# Altium schematic sheet Sheet1.SchDoc
size A4; SheetNumber: 1; SheetTotal: 1
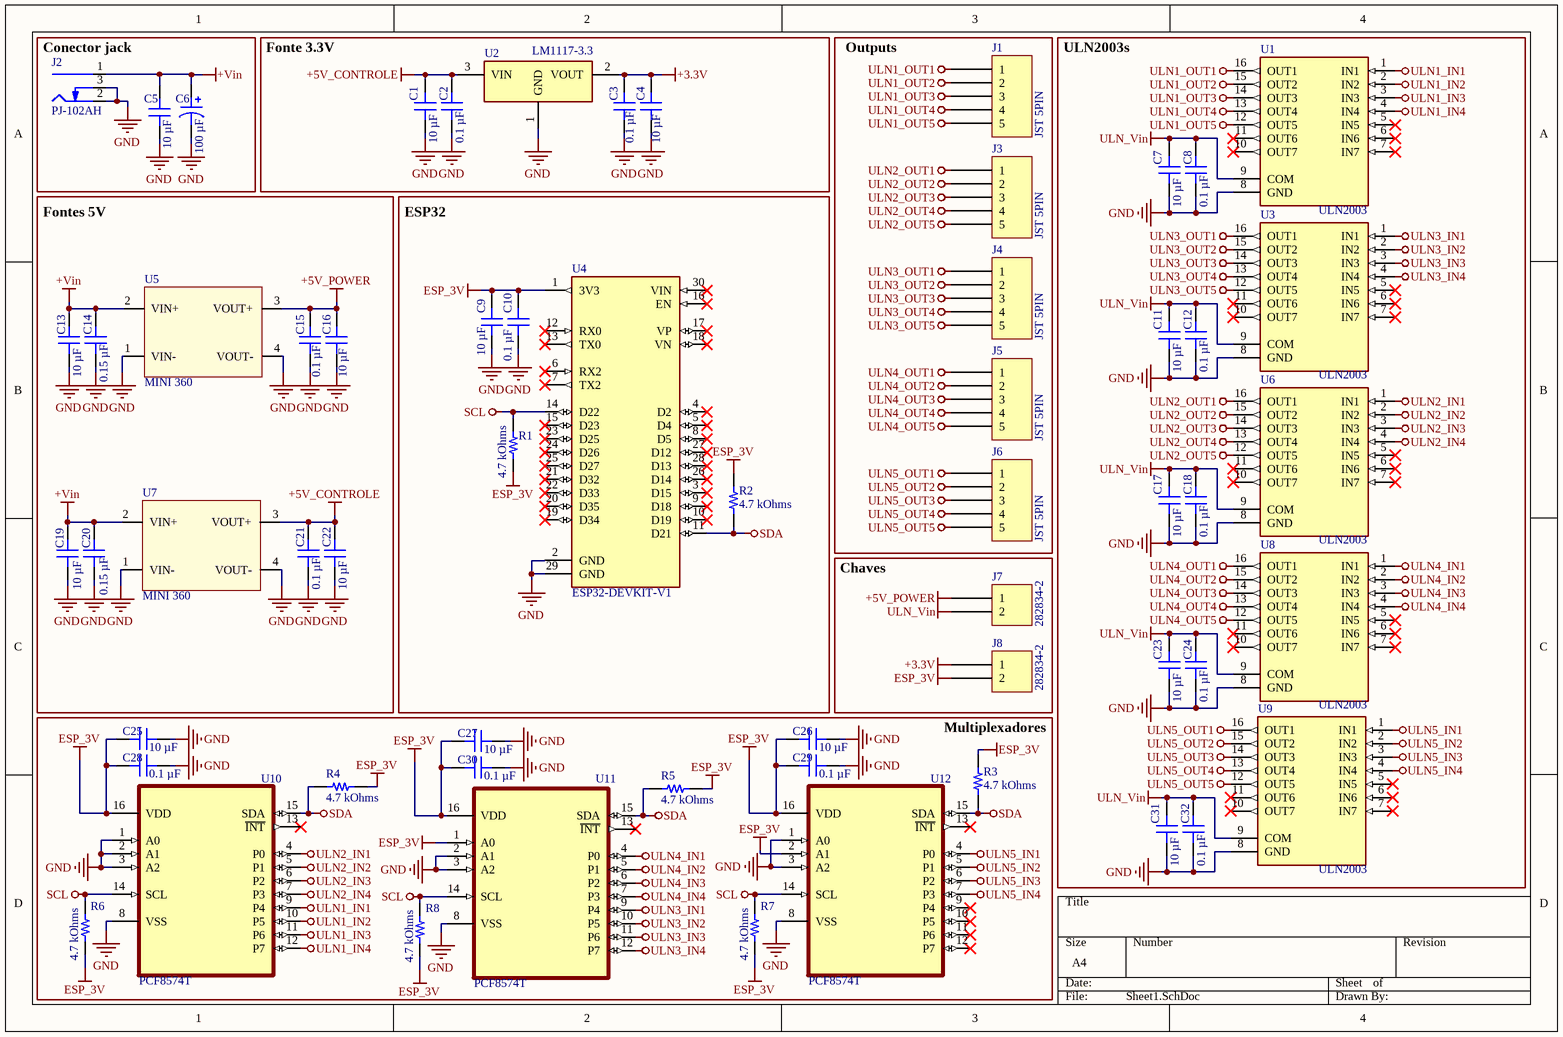
[diagram p0: Sheet1.SchDoc]

## Parts
C1  10 µF  [CAP 0603_1608]
C2  0.1 µF  [CAP 0603_1608]
C3  0.1 µF  [CAP 0603_1608]
C4  10 µF  [CAP 0603_1608]
C5  10 µF  [CAP 1206_3216 - 0.8MM]
C6  100 µF  [CAP AL TH D8 L3.5 H12.5]
C7  10 µF  [CAP 0603_1608]
C8  0.1 µF  [CAP 0603_1608]
C9  10 µF  [CAP 0603_1608]
C10  0.1 µF  [CAP 0603_1608]
C11  10 µF  [CAP 0603_1608]
C12  0.1 µF  [CAP 0603_1608]
C13  10 µF  [CAP 1206_3216 - 0.8MM]
C14  0.15 µF  [CAP 0805_2012]
C15  0.1 µF  [CAP 0603_1608]
C16  10 µF  [CAP 0603_1608]
C17  10 µF  [CAP 0603_1608]
C18  0.1 µF  [CAP 0603_1608]
C19  10 µF  [CAP 1206_3216 - 0.8MM]
C20  0.15 µF  [CAP 0805_2012]
C21  0.1 µF  [CAP 0603_1608]
C22  10 µF  [CAP 0603_1608]
C23  10 µF  [CAP 0603_1608]
C24  0.1 µF  [CAP 0603_1608]
C25  10 µF  [CAP 0603_1608]
C26  10 µF  [CAP 0603_1608]
C27  10 µF  [CAP 0603_1608]
C28  0.1 µF  [CAP 0603_1608]
C29  0.1 µF  [CAP 0603_1608]
C30  0.1 µF  [CAP 0603_1608]
C31  10 µF  [CAP 0603_1608]
C32  0.1 µF  [CAP 0603_1608]
J1  JST 5PIN  [JST XH B5B-XH-A]
J2  PJ-102AH  [CUI PJ-102AH]
J3  JST 5PIN  [JST XH B5B-XH-A]
J4  JST 5PIN  [JST XH B5B-XH-A]
J5  JST 5PIN  [JST XH B5B-XH-A]
J6  JST 5PIN  [JST XH B5B-XH-A]
J7  282834-2  [TE 282834-2]
J8  282834-2  [TE 282834-2]
R1  4.7 kOhms  [RES 0603_1608]
R2  4.7 kOhms  [RES 0603_1608]
R3  4.7 kOhms  [RES 0603_1608]
R4  4.7 kOhms  [RES 0603_1608]
R5  4.7 kOhms  [RES 0603_1608]
R6  4.7 kOhms  [RES 0603_1608]
R7  4.7 kOhms  [RES 0603_1608]
R8  4.7 kOhms  [RES 0603_1608]
U1  ULN2003  [DIP762W46P254L1969H533Q16]
U2  LM1117-3.3  [SOT-223]
U3  ULN2003  [DIP762W46P254L1969H533Q16]
U4  ESP32-DEVKIT-V1  [MODULE_ESP32_DEVKIT_V1]
U5  MINI 360  [MINI360]
U6  ULN2003  [DIP762W46P254L1969H533Q16]
U7  MINI 360  [MINI360]
U8  ULN2003  [DIP762W46P254L1969H533Q16]
U9  ULN2003  [DIP762W46P254L1969H533Q16]
U10  PCF8574T  [SOIC127P1032X265-16N]
U11  PCF8574T  [SOIC127P1032X265-16N]
U12  PCF8574T  [SOIC127P1032X265-16N]

## Blocks framed on the sheet
Conector jack: C5 C6 J2
Fonte 3.3V: C1-C4 U2
Outputs: J1 J3-J6
ULN2003s: C7 C8 C11 C12 C17 C18 C23 C24 C31 C32 U1 U3 U6 U8 U9
Fontes 5V: C13-C16 C19-C22 U5 U7
ESP32: C9 C10 R1 R2 U4
Chaves: J7 J8
Multiplexadores: C25-C30 R3-R8 U10-U12

## Nets
+3.3V: C3.1 C4.1 J8.1 U2.2(VOUT)
+5V_CONTROLE: C1.1 C2.1 C21.1 C22.1 U2.3(VIN) U7.3(VOUT+)
+5V_POWER: C15.1 C16.1 J7.1 U5.3(VOUT+)
+Vin: C5.1 C6.1 C13.1 C14.2 C19.1 C20.2 J2.1(Centre) U5.2(VIN+) U7.2(VIN+)
ESP_3V: C9.1 C10.1 C25.1 C26.1 C27.1 C28.1 C29.1 C30.1 J8.2 R1.2 R2.2 R3.2 R4.2 R5.2 R6.2 R7.2 R8.2 U4.1(3V3) U10.16(VDD) U11.1(A0) U11.16(VDD) U12.2(A1) U12.16(VDD)
GND: C1.2 C2.2 C3.2 C4.2 C5.2 C6.2 C7.2 C8.2 C9.2 C10.2 C11.2 C12.2 C13.2 C14.1 C15.2 C16.2 C17.2 C18.2 C19.2 C20.1 C21.2 C22.2 C23.2 C24.2 C25.2 C26.2 C27.2 C28.2 C29.2 C30.2 C31.2 C32.2 J2.2(Outer) J2.3(SW) U1.8(GND) U2.1(GND) U3.8(GND) U4.2(GND) U4.29(GND) U5.1(VIN-) U5.4(VOUT-) U6.8(GND) U7.1(VIN-) U7.4(VOUT-) U8.8(GND) U9.8(GND) U10.1(A0) U10.2(A1) U10.3(A2) U10.8(VSS) U11.2(A1) U11.3(A2) U11.8(VSS) U12.1(A0) U12.3(A2) U12.8(VSS)
SCL: R1.1 R6.1 R7.1 R8.1 U4.14(D22) U10.14(SCL) U11.14(SCL) U12.14(SCL)
SDA: R2.1 R3.1 R4.1 R5.1 U4.11(D21) U10.15(SDA) U11.15(SDA) U12.15(SDA)
ULN1_IN1: U1.1(IN1) U10.9(P4)
ULN1_IN2: U1.2(IN2) U10.10(P5)
ULN1_IN3: U1.3(IN3) U10.11(P6)
ULN1_IN4: U1.4(IN4) U10.12(P7)
ULN1_OUT1: J1.1 U1.16(OUT1)
ULN1_OUT2: J1.2 U1.15(OUT2)
ULN1_OUT3: J1.3 U1.14(OUT3)
ULN1_OUT4: J1.4 U1.13(OUT4)
ULN1_OUT5: J1.5 U1.12(OUT5)
ULN2_IN1: U6.1(IN1) U10.4(P0)
ULN2_IN2: U6.2(IN2) U10.5(P1)
ULN2_IN3: U6.3(IN3) U10.6(P2)
ULN2_IN4: U6.4(IN4) U10.7(P3)
ULN2_OUT1: J3.1 U6.16(OUT1)
ULN2_OUT2: J3.2 U6.15(OUT2)
ULN2_OUT3: J3.3 U6.14(OUT3)
ULN2_OUT4: J3.4 U6.13(OUT4)
ULN2_OUT5: J3.5 U6.12(OUT5)
ULN3_IN1: U3.1(IN1) U11.9(P4)
ULN3_IN2: U3.2(IN2) U11.10(P5)
ULN3_IN3: U3.3(IN3) U11.11(P6)
ULN3_IN4: U3.4(IN4) U11.12(P7)
ULN3_OUT1: J4.1 U3.16(OUT1)
ULN3_OUT2: J4.2 U3.15(OUT2)
ULN3_OUT3: J4.3 U3.14(OUT3)
ULN3_OUT4: J4.4 U3.13(OUT4)
ULN3_OUT5: J4.5 U3.12(OUT5)
ULN4_IN1: U8.1(IN1) U11.4(P0)
ULN4_IN2: U8.2(IN2) U11.5(P1)
ULN4_IN3: U8.3(IN3) U11.6(P2)
ULN4_IN4: U8.4(IN4) U11.7(P3)
ULN4_OUT1: J5.1 U8.16(OUT1)
ULN4_OUT2: J5.2 U8.15(OUT2)
ULN4_OUT3: J5.3 U8.14(OUT3)
ULN4_OUT4: J5.4 U8.13(OUT4)
ULN4_OUT5: J5.5 U8.12(OUT5)
ULN5_IN1: U9.1(IN1) U12.4(P0)
ULN5_IN2: U9.2(IN2) U12.5(P1)
ULN5_IN3: U9.3(IN3) U12.6(P2)
ULN5_IN4: U9.4(IN4) U12.7(P3)
ULN5_OUT1: J6.1 U9.16(OUT1)
ULN5_OUT2: J6.2 U9.15(OUT2)
ULN5_OUT3: J6.3 U9.14(OUT3)
ULN5_OUT4: J6.4 U9.13(OUT4)
ULN5_OUT5: J6.5 U9.12(OUT5)
ULN_Vin: C7.1 C8.1 C11.1 C12.1 C17.1 C18.1 C23.1 C24.1 C31.1 C32.1 J7.2 U1.9(COM) U3.9(COM) U6.9(COM) U8.9(COM) U9.9(COM)

Not connected (* = marked no-connect by the designer): U1 5(IN5)* 6(IN6)* 7(IN7)* 10(OUT7)* 11(OUT6)*; U3 5(IN5)* 6(IN6)* 7(IN7)* 10(OUT7)* 11(OUT6)*; U4 3(D15)* 4(D2)* 5(D4)* 6(RX2)* 7(TX2)* 8(D5)* 9(D18)* 10(D19)* 12(RX0)* 13(TX0)* 15(D23)* 16(EN)* 17(VP)* 18(VN)* 19(D34)* 20(D35)* 21(D32)* 22(D33)* 23(D25)* 24(D26)* 25(D27)* 26(D14)* 27(D12)* 28(D13)* 30(VIN)*; U6 5(IN5)* 6(IN6)* 7(IN7)* 10(OUT7)* 11(OUT6)*; U8 5(IN5)* 6(IN6)* 7(IN7)* 10(OUT7)* 11(OUT6)*; U9 5(IN5)* 6(IN6)* 7(IN7)* 10(OUT7)* 11(OUT6)*; U10 13(~{INT})*; U11 13(~{INT})*; U12 9(P4)* 10(P5)* 11(P6)* 12(P7)* 13(~{INT})*

## Library data of the parts
C1 C4 C7 C9 C11 C16 C17 C22 C23 C25-C27 C31 = GRM188R60J106ME47D: CAP CER 10UF 6.3V X5R 0603; manufacturer: Murata Electronics; Tolerance: ±20%; Part Number: GRM188R60J106ME47D; Capacitance: 10 µF; Applications: General Purpose; componentlink1description: Datasheet; componentlink1url: https://www.murata.com/~/media/webrenewal/support/library/catalog/products/capacitor/mlcc/c02e.ashx?la=en-us; componentlink2description: DigiKey Link; componentlink2url: https://www.digikey.com/en/products/detail/murata-electronics/GRM188R60J106ME47D/965910; Device Package: 0603 (1608 Metric); lastupdated: 06/04/2026 19:23:52; Lifecycle Status: Active; Minimum Order: 1; Mounting Type: Surface Mount, MLCC; Operating Temperature: -55°C ~ 85°C; Package / Case: 0603 (1608 Metric); packaging: TapeAndReel; partid: 2351; Part Status: Active; price: 0.01; series: GRM; Size / Dimension: 0.063" L x 0.031" W (1.60mm x 0.80mm); Supplier 1: DigiKey; Supplier Part Number 1: 490-3896-1-ND; Temperature Coefficient: X5R; Thickness (Max): 0.035" (0.90mm); value: 10 µF; Voltage - Rated: 6.3V
C2 C3 C8 C10 C12 C15 C18 C21 C24 C28-C30 C32 = 6R3X14W104MV4T: CAP CER 0.1UF 6.3V X7R 0603; manufacturer: Johanson Dielectrics Inc.; Tolerance: ±20%; Part Number: 6R3X14W104MV4T; Capacitance: 0.1 µF; Applications: Bypass, Decoupling; componentlink1description: Datasheet; componentlink1url: https://www.johansondielectrics.com/downloads/x2y-filter-and-decoupling-capacitors.pdf; componentlink2description: DigiKey Link; componentlink2url: https://www.digikey.com/en/products/detail/johanson-dielectrics-inc/6R3X14W104MV4T/1556331; Device Package: 0603 (1608 Metric); Features: Low ESL (X2Y); lastupdated: 06/04/2026 19:23:51; Lifecycle Status: Active; Minimum Order: 1; Mounting Type: Surface Mount, MLCC; Operating Temperature: -55°C ~ 125°C; Package / Case: 0603 (1608 Metric); packaging: TapeAndReel; partid: 2650; Part Status: Active; price: 0.08; series: X2Y®; Size / Dimension: 0.064" L x 0.035" W (1.63mm x 0.89mm); Supplier 1: DigiKey; Supplier Part Number 1: 709-1009-1-ND; Temperature Coefficient: X7R; Thickness (Max): 0.026" (0.66mm); value: 0.1 µF; Voltage - Rated: 6.3V
C5 C13 C19 = EMK316BJ106MD-T: CAP CER 10UF 16V X5R 1206; manufacturer: Taiyo Yuden; Tolerance: ±20%; Part Number: EMK316BJ106MD-T; Capacitance: 10 µF; Applications: SMPS Filtering; componentlink1description: Datasheet; componentlink1url: http://www.yuden.co.jp/productdata/catalog/mlcc06_e.pdf; componentlink2description: DigiKey Link; componentlink2url: https://www.digikey.com/en/products/detail/taiyo-yuden/EMK316BJ106MD-T/6563474; Device Package: 1206 (3216 Metric); lastupdated: 06/04/2026 19:37:58; Lifecycle Status: Active; Minimum Order: 1; Mounting Type: Surface Mount, MLCC; Operating Temperature: -55°C ~ 85°C; Package / Case: 1206 (3216 Metric); packaging: TapeAndReel; partid: 18996; Part Status: Active; price: 0.04; series: M; Size / Dimension: 0.126" L x 0.063" W (3.20mm x 1.60mm); Supplier 1: DigiKey; Supplier Part Number 1: 587-4881-1-ND; Temperature Coefficient: X5R; Thickness (Max): 0.037" (0.95mm); value: 10 µF; Voltage - Rated: 16V
C6 = UKL1C101MPD1TD: CAP ALUM 100UF 20% 16V RADIAL; manufacturer: Nichicon; Lifetime @ Temp.: 2000 Hrs @ 85°C; Polarization: Polar; Ripple Current @ High Frequency: 345 mA @ 10 kHz; Ripple Current @ Low Frequency: 230 mA @ 120 Hz; Part Number: UKL1C101MPD1TD; Applications: General Purpose; Capacitance: 100 µF; componentlink1description: Datasheet; componentlink1url: http://nichicon-us.com/english/products/pdfs/e-ukl.pdf; componentlink2description: DigiKey Link; componentlink2url: https://www.digikey.com/en/products/detail/nichicon/UKL1C101MPD1TD/4317967; Device Package: Radial, Can; Height - Seated (Max): 0.492" (12.50mm); lastupdated: 05/04/2026 20:45:14; Lead Spacing: 0.138" (3.50mm); Lifecycle Status: Active; Minimum Order: 1; Mounting Type: Through Hole; Operating Temperature: -40°C ~ 85°C; Package / Case: Radial, Can; packaging: TapeAndBox; partid: 7193; Part Status: Active; price: 0.16; series: UKL; Size / Dimension: 0.315" Dia (8.00mm); Supplier 1: DigiKey; Supplier Part Number 1: 493-10478-1-ND; Tolerance: ±20%; value: 100 µF; Voltage - Rated: 16 V
C14 C20 = C0805C154K5RACAUTO: CAP CER 0.15UF 50V X7R 0805; manufacturer: KEMET; Tolerance: ±10%; Part Number: C0805C154K5RACAUTO; Capacitance: 0.15 µF; Applications: Automotive, Bypass, Decoupling; componentlink1description: Datasheet; componentlink1url: https://api.kemet.com/component-edge/download/datasheet/C0805C154K5RACAUTO.pdf; componentlink2description: DigiKey Link; componentlink2url: https://www.digikey.com/en/products/detail/kemet/C0805C154K5RACAUTO/7516122; Device Package: 0805 (2012 Metric); lastupdated: 06/04/2026 19:32:54; Lifecycle Status: Active; Minimum Order: 1; Mounting Type: Surface Mount, MLCC; Operating Temperature: -55°C ~ 125°C; Package / Case: 0805 (2012 Metric); packaging: TapeAndReel; partid: 10068; Part Status: Active; price: 0.10; Ratings: AEC-Q200; series: SMD Auto X7R; Size / Dimension: 0.079" L x 0.049" W (2.00mm x 1.25mm); Supplier 1: DigiKey; Supplier Part Number 1: 399-15888-1-ND; Temperature Coefficient: X7R; Thickness (Max): 0.039" (1.00mm); value: 0.15 µF; Voltage - Rated: 50V
J1 J3-J6 = B5B-XH-A(LF)(SN): CONN HEADER VERT 5POS 2.5MM; Manufacturer: JST Sales America Inc.; Contact Length - Post: 0.134" (3.40mm); Current Rating (Amps): 3A; Material Flammability Rating: UL94 V-0; Number of Positions: 5; Number of Positions Loaded: All; Pitch - Mating: 0.098" (2.50mm); Shrouding: Shrouded - 4 Wall; Style: Board to Cable/Wire; Voltage Rating: 250V; Part Number: B5B-XH-A(LF)(SN); ComponentLink1Description: Datasheet; ComponentLink1URL: http://www.jst-mfg.com/product/pdf/eng/eXH.pdf; ComponentLink2Description: DigiKey Link; ComponentLink2URL: http://digikey.com/product-detail/en/jst-sales-america-inc/B5B-XH-A-LF-SN/455-2270-ND/1530483; Connector Type: Header; Contact Finish - Mating: Tin; Contact Finish - Post: Tin; Contact Material: Brass; Contact Shape: Square; Contact Type: Male Pin; Fastening Type: Detent Lock; Insulation Color: Natural; Insulation Height: 0.276" (7.00mm); Insulation Material: Polyamide (PA66), Nylon 6/6; LastUpdated: 12/01/2020 23:46:46; Lifecycle Status: Active; Minimum Order: 1; Mounting Type: Through Hole; Number of Rows: 1; Operating Temperature: -25°C ~ 85°C; Packaging: Bulk; PartId: 70; Part Status: Active; Price: 0.25; Series: XH; Supplier 1: DigiKey; Supplier Part Number 1: 455-2270-ND; Termination: Press-Fit, Solder
J2 = PJ-102AH: CONN PWR JACK 2X5.5MM SOLDER; Manufacturer: CUI Devices; Actual Diameter: 0.079" (2.00mm ID), 0.256" (6.50mm OD); Current Rating (Amps): 5A; Gender: Male; Industry Recognized Mating Diameter: 2.00mm ID (0.079"), 5.50mm OD (0.217"); Internal Switch(s): Single Switch, Normally Closed; Material Flammability Rating: UL94 V-0; Mating Length/Depth: 0.354" (9.00mm); Number of Positions/Contacts: 2 Conductors, 3 Contacts; Shielding: Unshielded; Voltage - Rated: 24VDC; Part Number: PJ-102AH; ComponentLink1Description: Datasheet; ComponentLink1URL: https://www.cuidevices.com/product/resource/digikeypdf/pj-102ah.pdf; ComponentLink2Description: DigiKey Link; ComponentLink2URL: //digikey.com/product-detail/en/cui-devices/PJ-102AH/CP-102AH-ND/408448; Connector Type: Jack; LastUpdated: 16/12/2019 19:01:27; Lifecycle Status: 0; Minimum Order: 1; Mounting Type: Through Hole, Right Angle; Packaging: Tray; Part Status: Active; Price: 0.76; Series: -; Supplier 1: DigiKey; Supplier Part Number 1: CP-102AH-ND; Termination: Solder
J7 J8 = 282834-2: TERM BLK 2P SIDE ENT 2.54MM PCB; Manufacturer: TE Connectivity AMP Connectors; Current: 10A; Mating Orientation: Horizontal with Board; Number of Levels: 1; Pitch: 0.100" (2.54mm); Positions Per Level: 2; Voltage: 150V; Wire Gauge: 16-30 AWG; Wire Termination: Screw - Rising Cage Clamp; Part Number: 282834-2; Color: Green; ComponentLink1Description: Datasheet; ComponentLink1URL: https://www.te.com/commerce/DocumentDelivery/DDEController?Action=srchrtrv&DocNm=282834&DocType=Customer+Drawing&DocLang=English; ComponentLink2Description: DigiKey Link; ComponentLink2URL: http://digikey.com/product-detail/en/te-connectivity-amp-connectors/282834-2/A98333-ND/1150135; LastUpdated: 15/01/2020 04:15:38; Lifecycle Status: Active; Minimum Order: 1; Mounting Type: Through Hole; Packaging: Bulk; Part Status: Active; Price: 0.88; Series: Buchanan; Supplier 1: DigiKey; Supplier Part Number 1: A98333-ND
R1-R8 = RT0603FRE074K7L: RES SMD 4.7K OHM 1% 1/10W 0603; Manufacturer: Yageo; Power (Watts): 0.1W, 1/10W; Temperature Coefficient: ±50ppm/°C; Part Number: RT0603FRE074K7L; Value: 4.7 kOhms; ComponentLink1Description: Datasheet; ComponentLink1URL: https://www.yageo.com/upload/media/product/productsearch/datasheet/rchip/PYu-RT_1-to-0.01_RoHS_L_11.pdf; ComponentLink2Description: DigiKey Link; ComponentLink2URL: https://www.digikey.com/en/products/detail/yageo/RT0603FRE074K7L/1075404; Composition: Thin Film; Device Package: 0603 (1608 Metric); Height - Seated (Max): 0.022" (0.55mm); LastUpdated: 06/04/2026 19:44:01; Lifecycle Status: Active; Minimum Order: 1; Number of Terminations: 2; Operating Temperature: -55°C ~ 155°C; Package / Case: 0603 (1608 Metric); Packaging: TapeAndReel; PartId: 5678; Part Status: Active; Price: 0.01; Resistance: 4.7 kOhms; Series: RT; Size / Dimension: 0.063" L x 0.031" W (1.60mm x 0.80mm); Supplier 1: DigiKey; Supplier Part Number 1: YAG1238CT-ND; Supplier Device Package: 0603; Tolerance: ±1%
U1 U3 U6 U8 U9 = ULN2003: Bipolar (BJT) Transistor Array 7 NPN Darlington 50V 500mA - - Surface Mount 16-SOIC; MF: Texas Instruments; Check_prices: https://www.snapeda.com/parts/ULN2003/Texas+Instruments/view-part/?ref=eda; Package: SOIC-16 National Semiconductor; Availability: Not in stock; Value: *; MP: ULN2003; SnapEDA_Link: https://www.snapeda.com/parts/ULN2003/Texas+Instruments/view-part/?ref=snap; Price: None
U2 = LM1117-3.3: Linear Voltage Regulator IC Positive Fixed 1 Output 800mA DDPAK/TO-263-3; MF: Texas Instruments; SnapEDA_Link: https://www.snapeda.com/parts/LM1117-3.3/Texas+Instruments/view-part/?ref=snap; Package: None; Value: *; MP: LM1117-3.3; Check_prices: https://www.snapeda.com/parts/LM1117-3.3/Texas+Instruments/view-part/?ref=eda
U4 = ESP32-DEVKIT-V1: Dual core, Wi-Fi: 2.4 GHz up to 150 Mbits/s,BLE (Bluetooth Low Energy) and legacy Bluetooth, 32 bits, Up to 240 MHz; MF: Do it; SnapEDA_Link: https://www.snapeda.com/parts/ESP32-DEVKIT-V1/Do+it/view-part/?ref=snap; Package: None; Value: *; MP: ESP32-DEVKIT-V1; Check_prices: https://www.snapeda.com/parts/ESP32-DEVKIT-V1/Do+it/view-part/?ref=eda
U10-U12 = PCF8574T: I/O Expander 8 IÂ²C 100 kHz 20-SSOP; MF: NXP Semiconductors; MP: PCF8574T; Price: None; Availability: In Stock; Package: SOIC-16 NXP Semiconductors; Purchase-URL: https://pricing.snapeda.com/search/part/PCF8574T/?ref=eda; SnapEDA_Link: https://www.snapeda.com/parts/PCF8574T/NXP+Semiconductors/view-part/?ref=snap; Value: *; Check_prices: https://www.snapeda.com/parts/PCF8574T/NXP+Semiconductors/view-part/?ref=eda